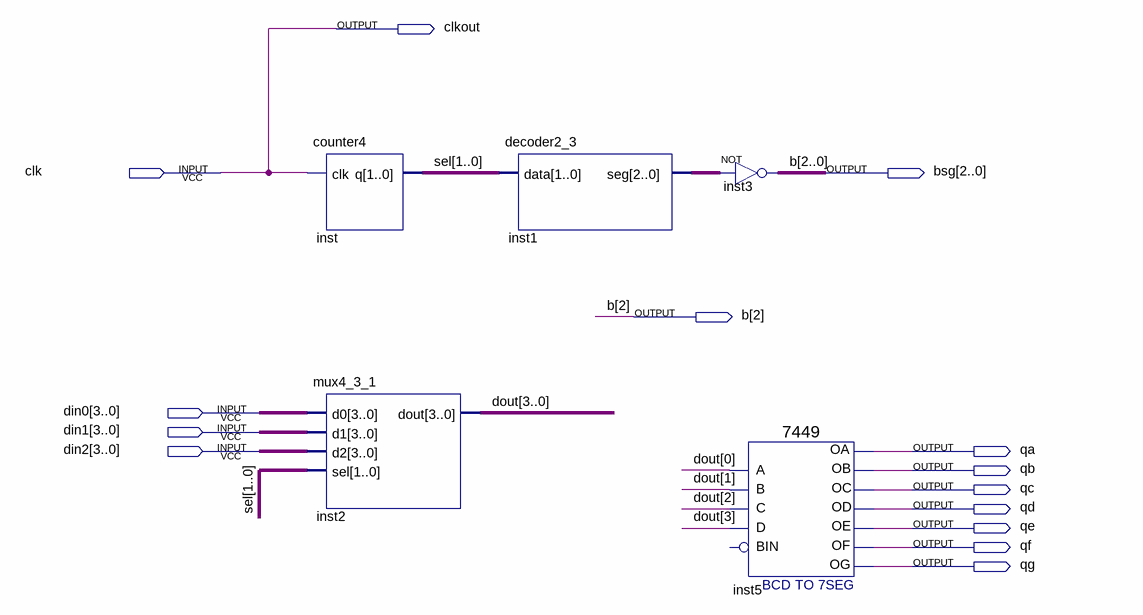
[diagram p0: schematic sheet]
// Quartus schematic scan_led3.bdf as structural Verilog: 5 symbols, 14 pins
module scan_led3 (
  input  clk,
  input  [3:0] din0,
  input  [3:0] din1,
  input  [3:0] din2,
  output clkout,
  output [2:0] bsg,
  output [2:2] b,
  output qa,
  output qb,
  output qc,
  output qd,
  output qe,
  output qf,
  output qg
);

  wire [1:0] sel;
  wire [2:0] inst1_seg;
  wire [3:0] dout;

  counter4 inst (.clk(clk), .q(sel));
  mux4_3_1 inst2 (.d0(din0), .d1(din1), .d2(din2), .sel(sel), .dout(dout));
  decoder2_3 inst1 (.data(sel), .seg(inst1_seg));
  assign {b[2], bsg[1:0]} = ~inst1_seg;  // NOT inst3, 3 bits wide
  \7449  inst5 (
    .A(dout[0]), .C(dout[2]), .B(dout[1]), .D(dout[3]), .OC(qc), .OD(qd), .OF(qf), .OG(qg), .OB(qb), .OA(qa),
    .OE(qe));  // open: BIN

  assign bsg[2] = b[2];
  assign clkout = clk;

  // Other names for the same wires on the sheet: b[1:0] = bsg[1:0]
endmodule
